# EAGLE design EyeTest (EAGLE 7.5.0)
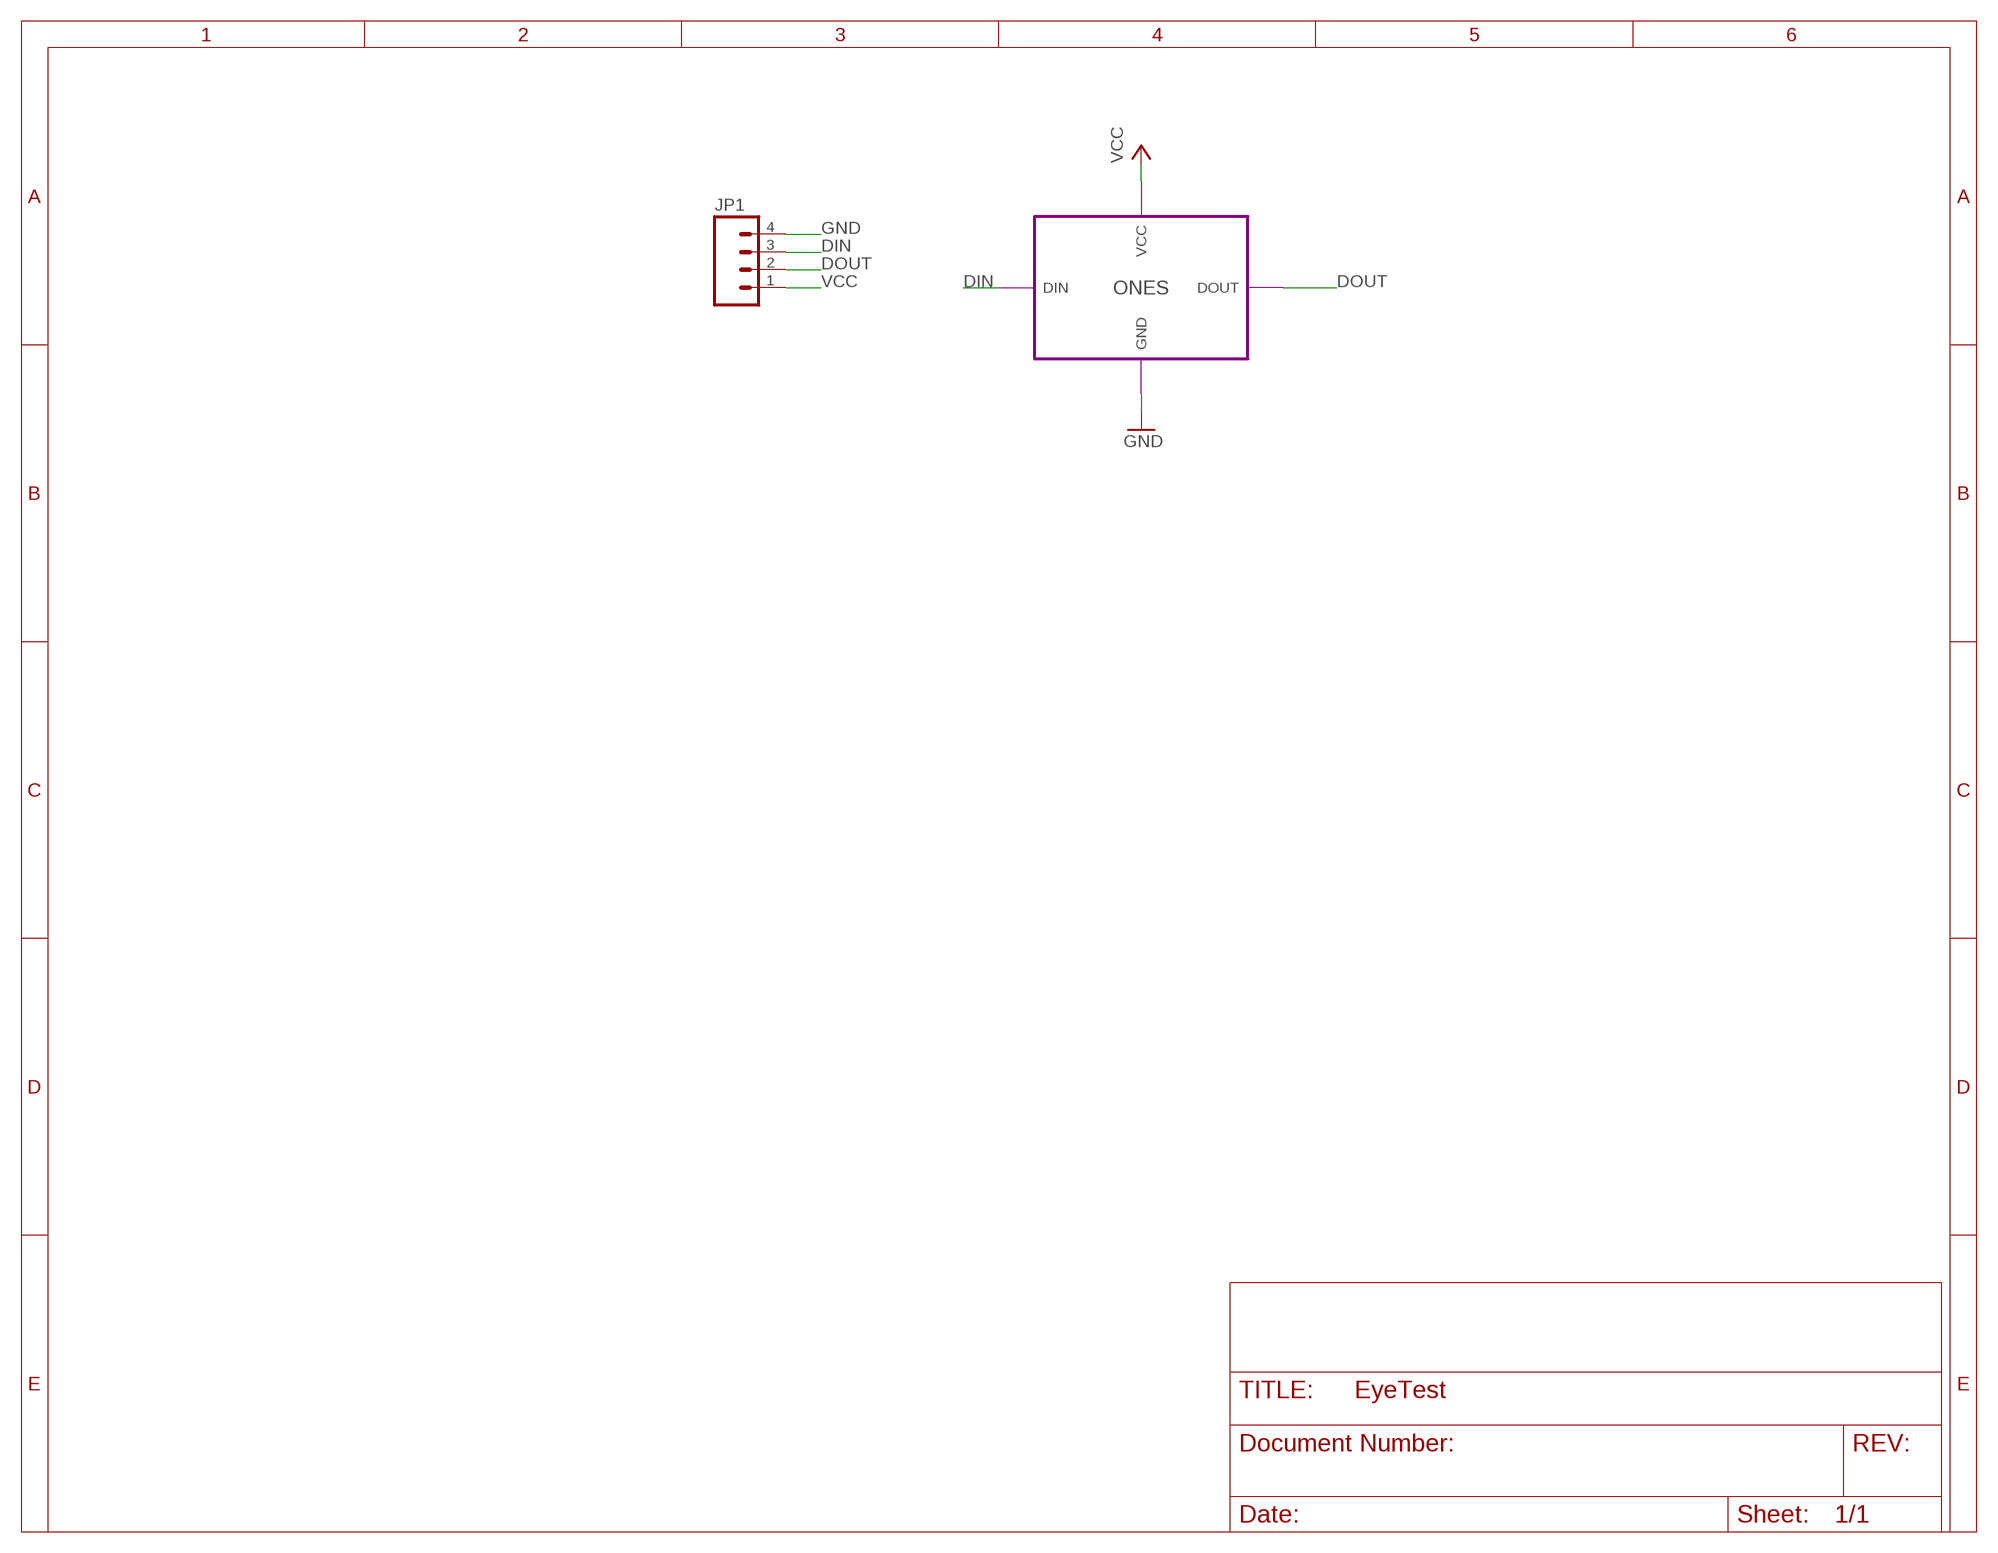
[diagram p0: schematic, sheet 1]

## Parts
JP1  M04LONGPADS  [1X04_LONGPADS]

## Module instances
ONES = LEDS

## Nets
DIN: JP1.3 ; port ONES.DIN
DOUT: JP1.2 ; port ONES.DOUT
GND: JP1.4 ; port ONES.GND
VCC: JP1.1 ; port ONES.VCC

## Library data of the parts
JP1 = SparkFun-Connectors:M04: Header 4 Standard 4-pin 0.1" header. Use with straight break away headers (SKU : PRT-00116), right angle break away headers (PRT-00553), swiss pins (PRT-00743), machine pins (PRT-00117), and female headers (PRT-00115). Molex polarized connector foot print use with SKU : PRT-08231 with associated crimp pins and housings. 1MM SMD Version SKU: PRT-10208

## Module LEDS
Ports: GND(pwr) VCC(pwr) DOUT(out) DIN(in)
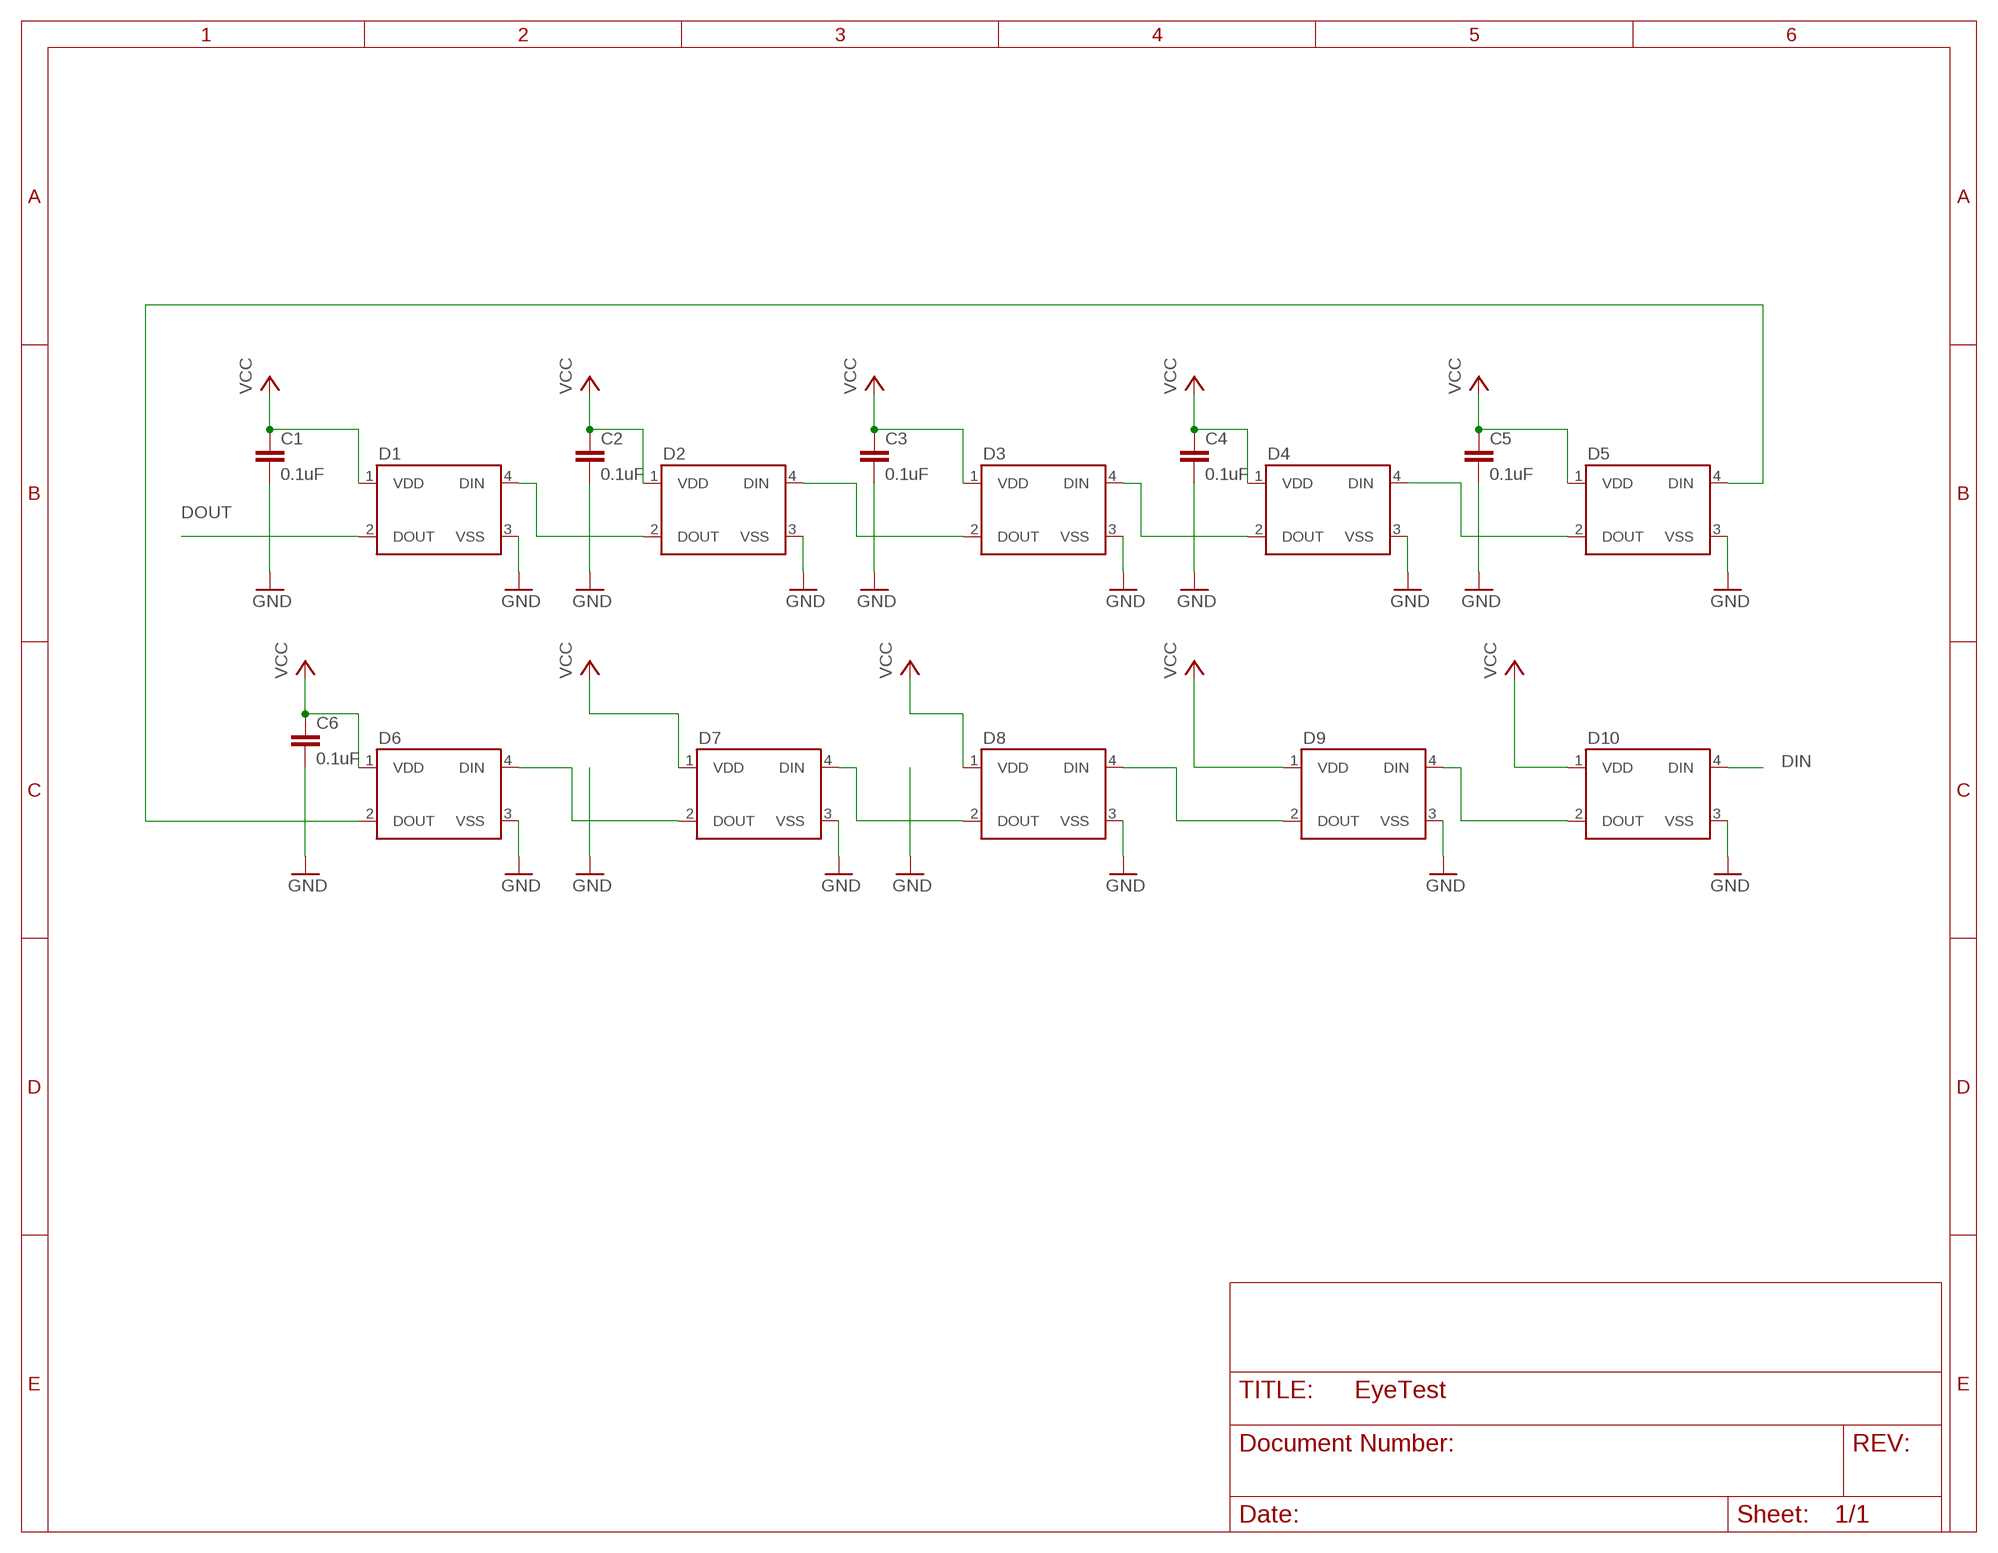
[diagram p1: schematic, module LEDS, sheet 1]

### Parts
C1  0.1uF  0.1UF-25V(+80/-20%)(0603)  [0603-CAP]
C2  0.1uF  0.1UF-25V(+80/-20%)(0603)  [0603-CAP]
C3  0.1uF  0.1UF-25V(+80/-20%)(0603)  [0603-CAP]
C4  0.1uF  0.1UF-25V(+80/-20%)(0603)  [0603-CAP]
C5  0.1uF  0.1UF-25V(+80/-20%)(0603)  [0603-CAP]
C6  0.1uF  0.1UF-25V(+80/-20%)(0603)  [0603-CAP]
D1  WS2812B  [WS2812B]
D2  WS2812B  [WS2812B]
D3  WS2812B  [WS2812B]
D4  WS2812B  [WS2812B]
D5  WS2812B  [WS2812B]
D6  WS2812B  [WS2812B]
D7  WS2812B  [WS2812B]
D8  WS2812B  [WS2812B]
D9  WS2812B  [WS2812B]
D10  WS2812B  [WS2812B]

### Nets
DIN: D10.4(DIN)
DOUT: D1.2(DOUT)
GND: C1.2 C2.2 C3.2 C4.2 C5.2 C6.2 D1.3(VSS) D2.3(VSS) D3.3(VSS) D4.3(VSS) D5.3(VSS) D6.3(VSS) D7.3(VSS) D8.3(VSS) D9.3(VSS) D10.3(VSS)
N$1: D2.4(DIN) D3.2(DOUT)
N$5: D1.4(DIN) D2.2(DOUT)
N$6: D3.4(DIN) D4.2(DOUT)
N$7: D4.4(DIN) D5.2(DOUT)
N$9: D5.4(DIN) D6.2(DOUT)
N$10: D6.4(DIN) D7.2(DOUT)
N$12: D7.4(DIN) D8.2(DOUT)
N$13: D8.4(DIN) D9.2(DOUT)
N$15: D9.4(DIN) D10.2(DOUT)
VCC: C1.1 C2.1 C3.1 C4.1 C5.1 C6.1 D1.1(VDD) D2.1(VDD) D3.1(VDD) D4.1(VDD) D5.1(VDD) D6.1(VDD) D7.1(VDD) D8.1(VDD) D9.1(VDD) D10.1(VDD)

### Library data of the parts
C1-C6 = SparkFun-Capacitors:0.1UF-25V(+80/-20%)(0603): CAP-00810 Ceramic Standard decoupling cap; PROD_ID: CAP-00810
D1-D10 = SparkFun-LED:WS2812B: WS2812B - Intelligent control LED integrated light source Technical Specifications: Power Supply Voltage (VDD): 3.5 to 5.3 V Input Voltage (VI): -0.5 to VDD+0.5 V Operating Junction Temperature (Topt): -25°C to +80°C Storage Temperature Range (Tstg): -55°C to +150°C

## Board
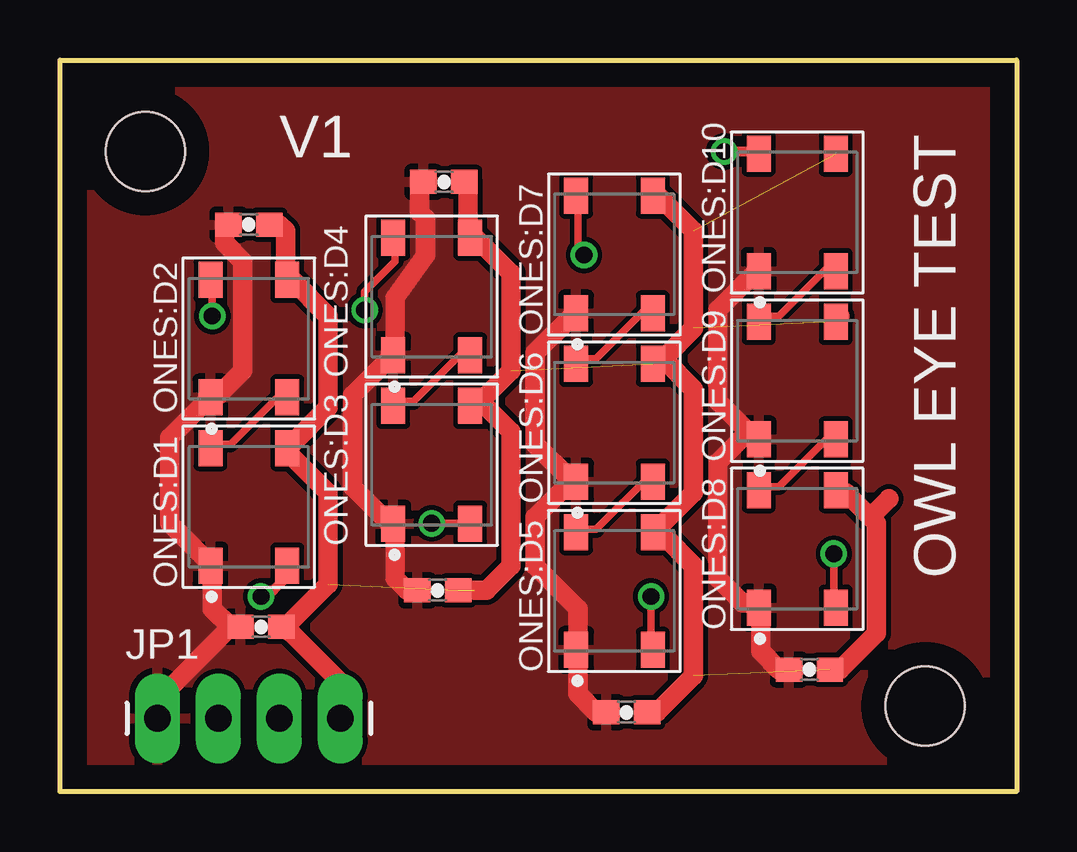
[diagram p2: board, top side]
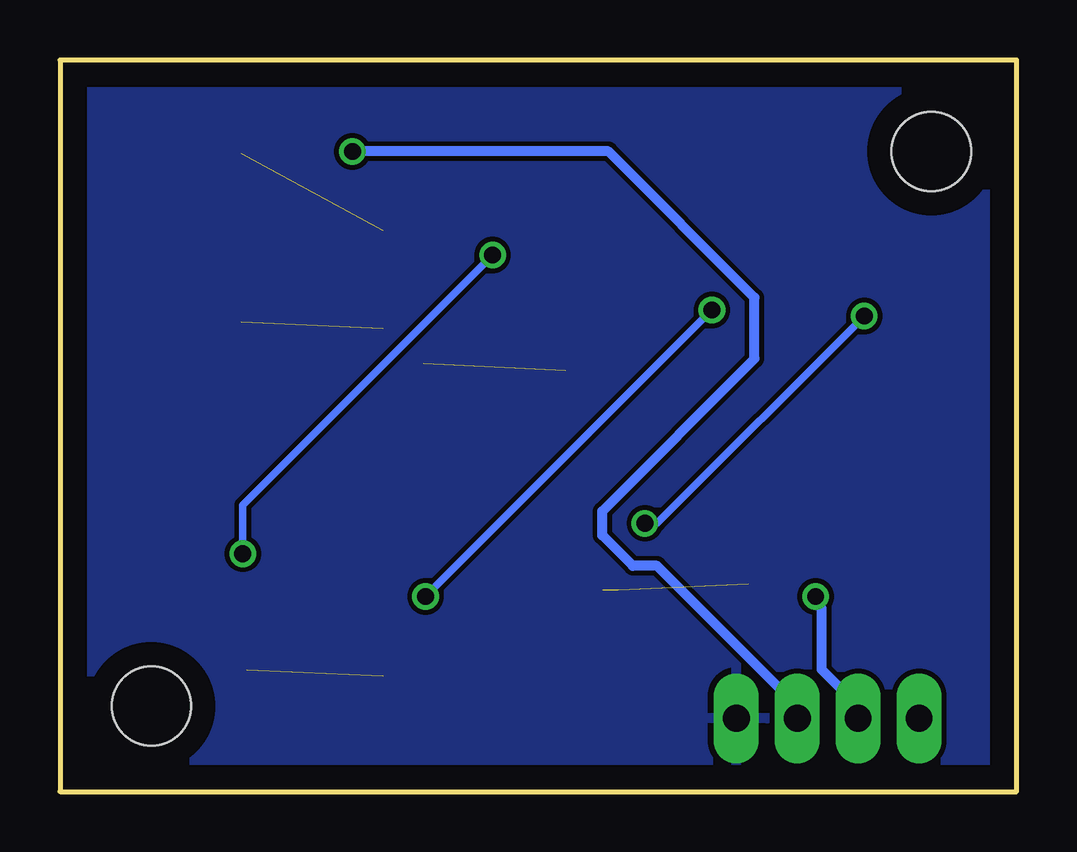
[diagram p3: board, bottom side, seen from below]

Size 39.88 x 30.48 mm. Coordinates in mm from the lower left corner, seen from the top.
Outline: 0,30.48 39.88,30.48 39.88,0 0,0 0,30.48
Copper layers (1*16): Top 0.035mm / dielectric 1.5mm / Bottom 0.035mm
Design rules "default *": minimum track width 10mil, minimum drill 24mil, track to track 8mil, track to pad 8mil, pad to pad 8mil, via to via 8mil, smd to smd 8mil, copper to edge 40mil, drill to drill 8mil, minimum pad ring 10mil, minimum via ring 8mil, stop-mask expansion 4mil, vias tented up to drill 28mil, thermal gap 10mil

### Footprints (pad centres in the part's own frame; a part is rotated, then mirrored left to right if it is on the bottom)
1X04_LONGPADS = drill 1.118 pad 1.88 long: 1 0,0; 2 2.54,0; 3 5.08,0; 4 7.62,0
0603-CAP = smd 1.1 x 1: 1 -0.85,0; 2 0.85,0
WS2812B = smd 1.5 x 1: 1 -2.45,1.6; 2 -2.45,-1.6; 3 2.45,-1.6; 4 2.45,1.6
STAND-OFF = hole 3.302: 0,0

### Placement (x,y rotation side)
JP1  4.06,3.05 0 top
ONES:C1  0.1uF  [0603-CAP]  8.38,6.86 0 top
ONES:C2  0.1uF  [0603-CAP]  15.75,8.38 0 top
ONES:C3  0.1uF  [0603-CAP]  23.62,3.3 0 top
ONES:C4  0.1uF  [0603-CAP]  31.24,5.08 0 top
ONES:C5  0.1uF  [0603-CAP]  7.87,23.62 0 top
ONES:C6  0.1uF  [0603-CAP]  16,25.4 0 top
ONES:D1  [WS2812B]  7.87,11.86 90 top
ONES:D2  [WS2812B]  7.87,18.87 90 top
ONES:D3  [WS2812B]  15.49,13.61 90 top
ONES:D4  [WS2812B]  15.49,20.62 90 top
ONES:D5  [WS2812B]  23.11,8.36 90 top
ONES:D6  [WS2812B]  23.11,15.37 90 top
ONES:D7  [WS2812B]  23.11,22.38 90 top
ONES:D8  [WS2812B]  30.73,10.11 90 top
ONES:D9  [WS2812B]  30.73,17.12 90 top
ONES:D10  [WS2812B]  30.73,24.13 90 top
U$1  [STAND-OFF]  3.56,26.67 0 top
U$2  [STAND-OFF]  36.07,3.56 0 top

### Tracks (layer width: path | path; a pad name or v marks a point on that pad's centre or on a via)
DIN  (via drill 0.7)
  Top 0.406: v27.69,26.67 28.96,26.67 ONES:D10.4
  Bottom 0.406: v27.69,26.67 17.02,26.67 10.92,20.57 10.92,18.03 17.27,11.68 17.27,10.67 16,9.4 14.99,9.4 9.14,3.56 JP1.3
DOUT  (via drill 0.7)
  Top 0.406: v8.38,8.13 8.64,8.38 8.89,8.38 9.4,8.89 9.4,9.4 ONES:D1.2
  Bottom 0.406: v8.38,8.13 8.38,7.87 8.13,7.62 8.13,5.08 6.6,3.56 JP1.2
GND  (6 unrouted)
  Top 0.813: 32.51,19.81 ONES:D9.3 | ONES:D7.3 24.89,24.89 26.42,23.37 26.42,19.3 25.15,18.03 | 25.15,18.03 24.89,18.03 ONES:D6.3 | 25.15,18.03 26.42,16.76 26.42,12.45 24.89,10.92 ONES:D5.3 25.15,10.67 26.42,9.4 26.42,4.83 24.89,3.3 ONES:C3.2 | 17.53,16.26 17.27,16.26 ONES:D3.3 | 17.53,16.26 18.8,17.53 18.8,21.59 17.27,23.11 ONES:D4.3 17.02,23.37 17.02,25.4 ONES:C6.2 | 17.53,16.26 18.8,14.99 18.8,9.4 17.78,8.38 17.27,8.38 | ONES:C4.2 32.51,5.08 34.04,6.6 34.04,11.18 33.78,11.43 | 33.78,11.43 32.77,12.45 ONES:D8.3 | ONES:C5.2 9.14,23.62 9.4,23.37 9.4,21.59 ONES:D2.3 9.65,21.34 11.18,19.81 11.18,16 9.65,14.48 ONES:D1.3 9.65,13.97 11.18,12.45 11.18,8.64 9.4,6.86 ONES:C1.2 9.65,6.6 11.68,4.57 JP1.4 | 34.54,12.19 33.78,11.43
  pour Bottom: 0,0 0,30.48 39.88,30.48 39.88,0
ONES:N$1  (via drill 0.7 pad 0.61)
  Top 0.305: v15.49,11.18 17.02,11.18 ONES:D3.2 | v6.35,19.81 6.35,21.08 ONES:D2.4
  Bottom 0.305: v15.49,11.18 14.99,11.18 v6.35,19.81
ONES:N$5
  Top 0.305: ONES:D1.4 6.35,14.48 7.11,14.48 9.4,16.76 9.65,16.51 ONES:D2.2
ONES:N$6
  Top 0.305: ONES:D3.4 13.97,16.26 14.73,16.26 17.02,18.54 17.27,18.29 ONES:D4.2
ONES:N$7  (via drill 0.7 pad 0.61)
  Top 0.305: v24.64,8.13 24.64,6.1 ONES:D5.2 | v12.7,20.07 12.7,20.83 13.97,22.1 13.97,22.86 ONES:D4.4
  Bottom 0.305: v12.7,20.07 v24.64,8.13
ONES:N$9
  Top 0.305: ONES:D5.4 21.59,10.92 22.35,10.92 24.64,13.21 24.89,12.95 ONES:D6.2
ONES:N$10
  Top 0.305: ONES:D6.4 21.59,18.03 22.35,18.03 24.64,20.32 24.89,20.07 ONES:D7.2
ONES:N$12  (via drill 0.7 pad 0.61)
  Top 0.305: v32.26,9.91 32.26,7.87 ONES:D8.2 | v21.84,22.35 21.59,22.61 21.59,24.64 ONES:D7.4
  Bottom 0.305: v32.26,9.91 32.26,11.94 v21.84,22.35
ONES:N$13
  Top 0.305: ONES:D8.4 29.21,12.7 29.97,12.7 32.26,14.99 32.51,14.73 ONES:D9.2
ONES:N$15
  Top 0.305: ONES:D9.4 29.21,19.81 29.97,19.81 32.26,22.1 32.51,21.84 ONES:D10.2
VCC
  Top 0.813: ONES:D10.1 28.96,21.59 27.43,20.07 27.43,16.26 28.7,14.99 | 28.7,14.99 28.96,14.73 ONES:D9.1 | 28.7,14.99 27.43,13.72 27.43,8.89 28.45,7.87 28.96,7.87 ONES:D8.1 29.21,7.37 29.21,5.84 29.97,5.08 ONES:C4.1 | ONES:D7.1 21.34,19.81 19.81,18.29 19.81,14.48 21.34,12.95 ONES:D6.1 21.08,12.7 19.81,11.43 19.81,9.4 21.59,7.62 21.59,6.1 ONES:D5.1 21.59,5.84 21.59,4.06 22.35,3.3 ONES:C3.1 | ONES:C2.1 14.48,8.38 13.97,8.89 13.97,10.92 ONES:D3.1 13.72,11.18 12.19,12.7 12.19,16.51 13.72,18.03 ONES:D4.1 13.97,18.54 13.97,20.57 15.24,22.35 15.24,23.88 14.99,24.13 14.99,25.4 ONES:C6.1 | 7.11,6.86 6.35,7.62 6.35,9.14 ONES:D1.1 6.1,9.65 4.57,11.18 4.57,14.73 6.1,16.26 ONES:D2.1 6.6,16.51 7.62,17.53 7.62,22.1 6.86,22.86 6.86,23.62 ONES:C5.1 | ONES:C1.1 7.11,6.86 | 7.11,6.86 4.06,3.81 JP1.1
  pour Top: 0,0 0,30.48 39.88,30.48 39.88,0

### Text on the board
tPlace: V1 | OWL EYE TEST